# EAGLE design chirp-sensor-v2.5.1 (EAGLE 6.4)
Plant watering alarm v2.4
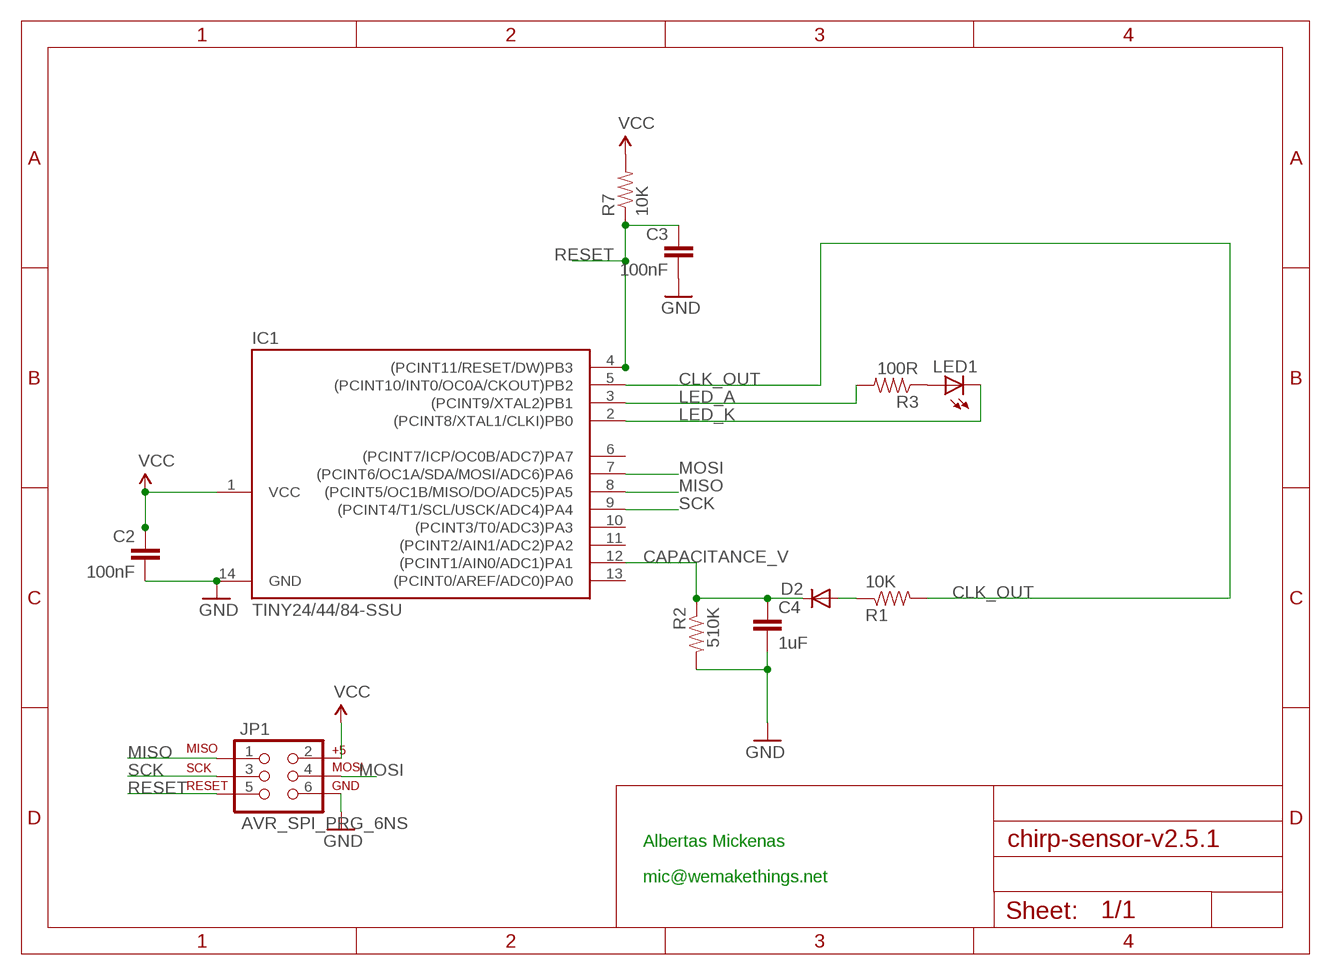
[diagram p0: schematic, sheet 1]

## Parts
C2  100nF  CAP0603-CAP  [0603-CAP]
C3  100nF  CAP0603-CAP  [0603-CAP]
C4  1uF  CAP0603-CAP  [0603-CAP]
D2  DIODE-SCHOTTKY_  DIODESOD-523  [SOD-523]
IC1  TINY24/44/84-SSU  [SOIC14]
JP1  AVR_SPI_PRG_6NS  [2X3-NS]
LED1  LEDCHIPLED_0805  [CHIPLED_0805]
R1  10K  RESISTOR0603-RES  [0603-RES]
R2  510K  RESISTOR0603-RES  [0603-RES]
R3  100R  RESISTOR0603-RES  [0603-RES]
R7  10K  RESISTOR0603-RES  [0603-RES]

## Nets
CAPACITANCE_V: C4.1 D2.K(C) IC1.12((PCINT1/AIN0/ADC1)PA1) R2.1
CLK_OUT: IC1.5((PCINT10/INT0/OC0A/CKOUT)PB2) R1.2
GND: C2.2 C3.2 C4.2 IC1.14(GND) JP1.6 R2.2
LED_A: IC1.3((PCINT9/XTAL2)PB1) R3.2
LED_K: IC1.2((PCINT8/XTAL1/CLKI)PB0) LED1.C
MISO: IC1.8((PCINT5/OC1B/MISO/DO/ADC5)PA5) JP1.1
MOSI: IC1.7((PCINT6/OC1A/SDA/MOSI/ADC6)PA6) JP1.4
N$2: LED1.A R3.1
RESET: C3.1 IC1.4((PCINT11/RESET/DW)PB3) JP1.5 R7.1
SCK: IC1.9((PCINT4/T1/SCL/USCK/ADC4)PA4) JP1.3
V_CAP: D2.A R1.1
VCC: C2.1 IC1.1(VCC) JP1.2 R7.2
Unconnected: IC1.6((PCINT7/ICP/OC0B/ADC7)PA7) IC1.10((PCINT3/T0/ADC3)PA3) IC1.11((PCINT2/AIN1/ADC2)PA2) IC1.13((PCINT0/AREF/ADC0)PA0)

## Notes on the sheet
- Albertas Mickenas
- mic@wemakethings.net

## Library data of the parts
C2-C4 = SparkFun:CAP: Capacitor Standard 0603 ceramic capacitor, and 0.1" leaded capacitor.
D2 = microbuilder:DIODE: Diode SMADIODE - SMA Surface Mount Package 20V 1A Schottky Diode Digikey (500mV @ 1A, 500uA Vr @ 20V): 641-1014-6-ND 10V 2A Schottky Diode Digikey (350mV @ 2A, 700uA Vr @ 10V): MBRA210LT3 SOD-123 30V 200mA (800mV Vf, 2uA Vr @ 25V) Schottky Diode (very fast switching for boost, etc.) - Digikey: BAT54T1GOSTR-ND 30V 500mA (430mV Vf, 130uA Vr @ 30V) Schottky Diode - Digikey: B0530W-FDICT-ND MBR120 1A 20V (0.34Vf) Schottky Diode - Digikey: MBR120VLSFT1GOSCT-ND SOD-323 10V 570mA (380mV Vf, 3ns) Schottky Diode - Digikey: ZLLS410CT-ND 1N4148WS - 75V 150mA (1V Vf @ 10mA, 4ns) Simple Diode - Digikey: 1N4148WSFSCT-ND, Mouser: 512-1N4148WS SOD-523 BAT54 30V 200mA Schottky (0.8 Vf @ 100mA, 5ns) - Digikey: BAT54XV2CT-ND 30V 30mA Schottky Diode (RB751S-40TE61) - Digikey: RB751S-40TE61CT-ND SOT23-R/W - SOT23 Package (R = Solder Paste/Reflow Ovens, W = Hand-Soldering) BAT54Film 40V 300mA - Digikey: 497-7162-1-ND DO-1N4148 Through Hole Small Current Diode (any model)
IC1 = avr-5:TINY24/44/84
JP1 = SparkFun:AVR_SPI_PRG_6: AVR ISP 6 Pin This is the reduced ISP connector for AVR programming. Common on Arduino. This footprint will take up less PCB space and can be used with a 10-pin to 6-pin adapter such as SKU: BOB-08508
LED1 = adafruit:LED: LED OSRAM: - CHIPLED LG R971, LG N971, LY N971, LG Q971, LY Q971, LO R971, LY R971 LH N974, LH R974 LS Q976, LO Q976, LY Q976 LO Q996 - Hyper CHIPLED LW Q18S LB Q993, LB Q99A, LB R99A - SideLED LS A670, LO A670, LY A670, LG A670, LP A670 LB A673, LV A673, LT A673, LW A673 LH A674 LY A675 LS A676, LA A676, LO A676, LY A676, LW A676 LS A679, LY A679, LG A679 - Hyper Micro SIDELED® LS Y876, LA Y876, LO Y876, LY Y876 LT Y87S - SmartLED LW L88C, LW L88S LB L89C, LB L89S, LG L890 LS L89K, LO L89K, LY L89K LS L896, LA L896, LO L896, LY L896 - TOPLED LS T670, LO T670, LY T670, LG T670, LP T670 LSG T670, LSP T670, LSY T670, LOP T670, LYG T670 LG T671, LOG T671, LSG T671 LB T673, LV T673, LT T673, LW T673 LH T674 LS T676, LA T676, LO T676, LY T676, LB T676, LH T676, LSB T676, LW T676 LB T67C, LV T67C, LT T67C, LS T67K, LO T67K, LY T67K, LW E67C LS E67B, LA E67B, LO E67B, LY E67B, LB E67C, LV E67C, LT E67C LW T67C LS T679, LY T679, LG T679 LS T770, LO T770, LY T770, LG T770, LP T770 LB T773, LV T773, LT T773, LW T773 LH T774 LS E675, LA E675, LY E675, LS T675 LS T776, LA T776, LO T776, LY T776, LB T776 LHGB T686 LT T68C, LB T68C - Hyper Mini TOPLED® LB M676 - Mini TOPLED Santana® LG M470 LS M47K, LO M47K, LY M47K Source: http://www.osram.convergy.de/
R1-R3 R7 = SparkFun:RESISTOR: Resistor Basic schematic elements and footprints for 0603, 1206, and PTH resistors.

## Board
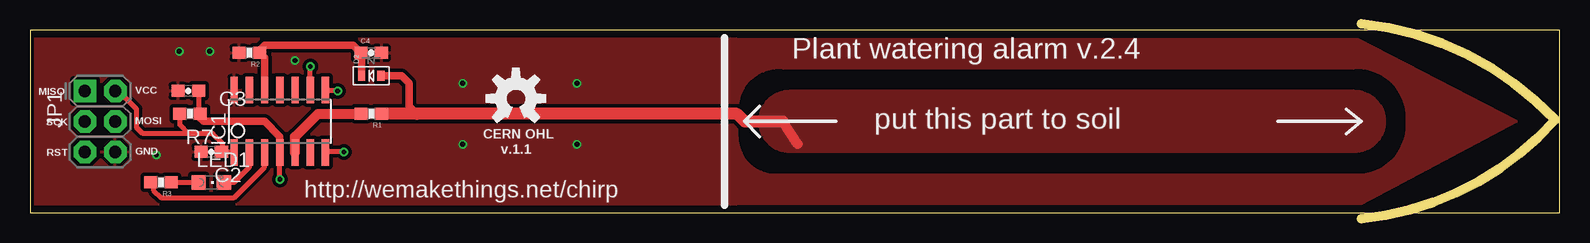
[diagram p1: board, top side]
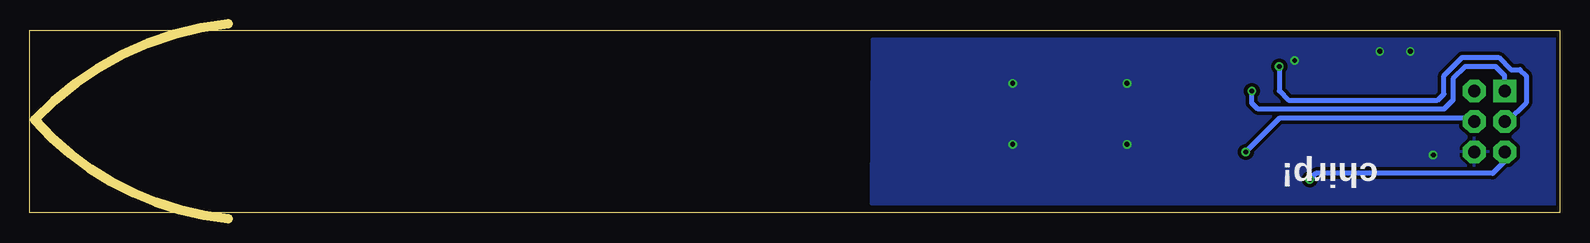
[diagram p2: board, bottom side, seen from below]

Size 127.51 x 15.24 mm. Coordinates in mm from the lower left corner, seen from the top.
Outline: 0,0 127.51,0 127.51,15.24 0,15.24 0,0
Copper layers (1*16): Top 0.035mm / dielectric 1.5mm / Bottom 0.035mm
Design rules "Fusion_eagle_rule_v1.1": minimum track width 6mil, minimum drill 12mil, track to track 6mil, track to pad 6mil, pad to pad 6mil, via to via 6mil, smd to smd 0mil, copper to edge 10mil, drill to drill 10mil, minimum pad ring 10mil, minimum via ring 6mil, stop-mask expansion 2mil, vias tented up to drill 100mil, thermal gap 10mil
Milling: 2 lines

### Footprints (pad centres in the part's own frame; a part is rotated, then mirrored left to right if it is on the bottom)
0603-CAP = smd 1.1 x 1: 1 -0.85,0; 2 0.85,0
SOD-523 = smd 0.8 x 0.6: A 0,-0.8; K 0,0.8
SOIC14 = smd 0.61 x 2.21: 1 -3.81,-2.603; 2 -2.54,-2.603; 3 -1.27,-2.603; 4 0,-2.603; 5 1.27,-2.603; 6 2.54,-2.603; 7 3.81,-2.603; 8 3.81,2.603; 9 2.54,2.603; 10 1.27,2.603; 11 0,2.603; 12 -1.27,2.603; 13 -2.54,2.603; 14 -3.81,2.603
2X3-NS = drill 1.016 pad 1.88 square: 1 -2.54,-1.27 | drill 1.016 pad 1.88 octagon: 2 -2.54,1.27; 3 0,-1.27; 4 0,1.27; 5 2.54,-1.27; 6 2.54,1.27
CHIPLED_0805 = smd 1.2 x 1.2: A 0,-1.05; C 0,1.05
0603-RES = smd 1.1 x 1: 1 -0.85,0; 2 0.85,0

### Placement (x,y rotation side)
C2  15.11,5.08 180 top
C3  13.21,10.16 180 top
C4  28.45,13.34 0 top
D2  28.45,11.43 90 top
IC1  20.83,7.62 0 top
JP1  5.84,7.62 270 top
LED1  15.11,2.54 270 top
R1  28.45,8.26 180 top
R2  18.29,13.34 180 top
R3  10.92,2.54 180 top
R7  13.34,8.26 180 top

### Tracks (layer width: path | path; a pad name or v marks a point on that pad's centre or on a via)
CAPACITANCE_V
  Top 0.406: 19.56,12.91 R2.1 19.14,13.55
  Top 0.61: 19.56,12.91 IC1.12 | 19.14,13.55 19.56,13.97 26.94,13.97 C4.1 27.65,13.29 D2.K
CLK_OUT
  Top 0.813: IC1.5 22.1,6.35 24,8.26 R1.2
GND  (via drill 0.4, 0.4 pad 0.3)
  other vias: 12.45,13.46 14.99,13.46 10.54,4.83 22.1,12.7 45.59,10.79 45.59,5.71 36.07,10.79 36.07,5.71
  pour Top (isolate 0.305): 0,14.47 0,0.76 58.93,0.76 58.93,14.47
  pour Bottom (isolate 0.305): 0,14.47 57.33,14.47 57.4,0.76 0,0.76
  pour Top (isolate 0.305, no thermals): 58.93,14.47 110.67,14.47 123.95,7.62 111,0.76 58.93,0.76 58.93,6.35 arc90 62.1,3.17 110.36,3.17 arc90 114.81,6.99 114.81,8.26 arc90 110.36,12.06 62.74,12.06 arc90 58.93,8.89
LED_A
  Top 0.406: IC1.3 19.56,3.81 17.02,1.27 10.92,1.27 10.29,1.91 10.29,2.33 R3.2
LED_K
  Top 0.406: IC1.2 18.29,3.81 17.02,2.54 LED1.C
MISO  (via drill 0.4 pad 0.3)
  Top 0.406: v25.65,10.16 24.7,10.16 IC1.8
  Bottom 0.406: v25.65,10.16 25.65,9.14 25.15,8.64 9.65,8.64 8.89,9.4 8.89,11.18 7.87,12.19 5.33,12.19 4.57,11.43 JP1.1
MOSI  (via drill 0.4 pad 0.3)
  Top 0.406: v26.16,5.08 24.7,5.08 IC1.7
  Bottom 0.406: v26.16,5.08 23.37,7.87 7.37,7.87 JP1.4
N$2
  Top 0.406: R3.1 LED1.A
RESET  (via drill 0.4 pad 0.3)
  Top 0.406: v20.83,2.79 IC1.4 | C3.1 14.06,8.38 R7.1 14.08,8.15 14.08,8.02
  Top 0.61: IC1.4 20.83,6.35 19.56,7.62 14.48,7.62 14.08,8.02
  Bottom 0.406: v20.83,2.79 20.32,3.3 5.59,3.3 4.57,4.32 JP1.5
SCK  (via drill 0.4 pad 0.3)
  Top 0.406: IC1.9 v23.37,12.19
  Bottom 0.406: v23.37,12.19 23.37,10.16 22.61,9.4 10.16,9.4 9.65,9.91 9.65,11.43 8.13,12.95 5.08,12.95 4.06,11.94 3.3,11.94 2.79,11.43 2.79,9.14 4.32,7.62 JP1.3
V_CAP
  Top 0.61: 32.26,8.26 31.62,8.89 31.62,10.79 30.99,11.43 D2.A
  Top 0.813: 62.74,7.62 63.99,5.74
  Top 1.016: 62.74,7.62 59.56,7.62 58.93,8.26 32.26,8.26 R1.1
  pour Top (no thermals): 60.83,7.62 arc-90 63.37,10.16 110.36,10.16 arc-90 112.9,7.62 arc-90 110.36,5.08 63.37,5.08 arc-90
VCC
  Top 0.406: IC1.1 16.95,5.08 C2.1 16,5.12 16,5.84 15.24,6.6 13.21,6.6 | JP1.2 7.37,10.16 8.89,8.64 8.89,7.11 9.4,6.6 13.21,6.6 | R7.2 12.48,7.33 13.21,6.6

### Text on the board
_tsilk: Plant watering alarm v.2.4 | MISO | VCC | SCK | MOSI | CERN OHL | put this part to soil | v.1.1 | RST | GND | http://wemakethings.net/chirp
_bsilk: chirp!